# EAGLE schematic microrovmk2 (EAGLE 7.2.0)
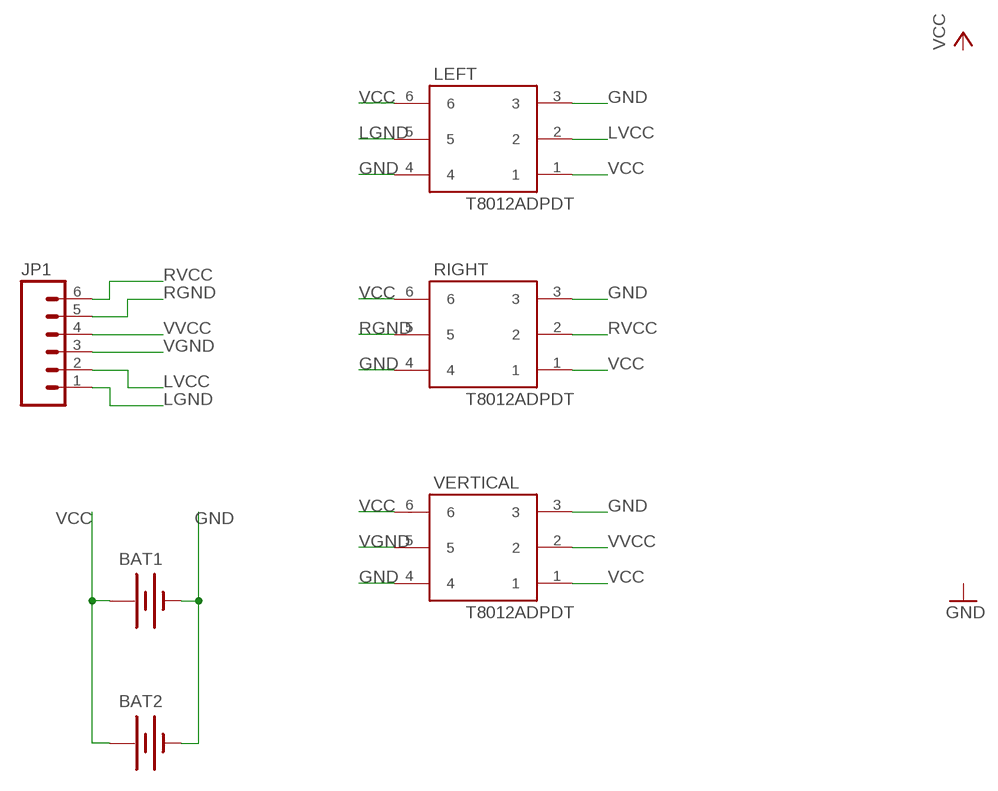
[diagram p0: schematic, sheet 1]

## Parts
BAT1  BATTERY9V  [BATTCON_9V]
BAT2  BATTERY9V  [BATTCON_9V]
JP1  M06LOCK_LONGPADS  [1X06_LOCK_LONGPADS]
LEFT  T8012ADPDT  [T8012A]
RIGHT  T8012ADPDT  [T8012A]
VERTICAL  T8012ADPDT  [T8012A]

## Nets
GND: BAT1.- BAT2.- LEFT.3 LEFT.4 RIGHT.3 RIGHT.4 VERTICAL.3 VERTICAL.4
LGND: JP1.1 LEFT.5
LVCC: JP1.2 LEFT.2
RGND: JP1.5 RIGHT.5
RVCC: JP1.6 RIGHT.2
VCC: BAT1.+ BAT2.+ LEFT.1 LEFT.6 RIGHT.1 RIGHT.6 VERTICAL.1 VERTICAL.6
VGND: JP1.3 VERTICAL.5
VVCC: JP1.4 VERTICAL.2

## Library data of the parts
BAT1 BAT2 = SparkFun-Electromechanical:BATTERY: Battery Holders Various common sizes : AA, AAA, 18650 (PRT-12895), 20mm coin cell and 12mm coin cell. 20MM_4LEGS, BATT-10373
JP1 = SparkFun-Connectors:M06: Header 6 Standard 6-pin 0.1" header. Use with straight break away headers (SKU : PRT-00116), right angle break away headers (PRT-00553), swiss pins (PRT-00743), machine pins (PRT-00117), and female headers (PRT-00115). Molex polarized connector foot print use with SKU : PRT-08094 with associated crimp pins and housings. NOTES ON THE VARIANTS LOCK and LOCK_LONGPADS... This footprint was designed to help hold the alignment of a through-hole component (i.e. 6-pin header) while soldering it into place. You may notice that each hole has been shifted either up or down by 0.005 of an inch from it's more standard position (which is a perfectly straight line). This slight alteration caused the pins (the squares in the middle) to touch the edges of the holes. Because they are alternating, it causes a "brace" to hold the component in place. 0.005 has proven to be the perfect amount of "off-center" position when using our standard breakaway headers. Although looks a little odd when you look at the bare footprint, once you have a header in there, the alteration is very hard to notice. Also,if you push a header all the way into place, it is covered up entirely on the bottom side. This idea of altering the position of holes to aid alignment will be further integrated into the Sparkfun Library for other footprints. It can help hold any component with 3 or more connection pins.
LEFT RIGHT VERTICAL = microROV:T8012A